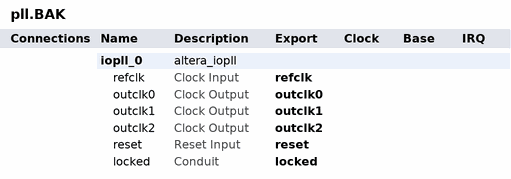
[diagram p0: system contents]
# Platform Designer (Qsys) system pll.BAK, Arria 10 10AS066H2F34I1HG
# Parameters at their usual value, and those the tool derives, are not listed.
package require -exact qsys 18.0
create_system pll.BAK
set_project_property DEVICE_FAMILY {Arria 10}
set_project_property DEVICE 10AS066H2F34I1HG

add_instance iopll_0 altera_iopll 18.0
set_instance_property iopll_0 AUTO_EXPORT true
set_instance_parameter_value iopll_0 gui_c_cnt_in_src0 c_m_cnt_in_src_ph_mux_clk
set_instance_parameter_value iopll_0 gui_c_cnt_in_src1 c_m_cnt_in_src_ph_mux_clk
set_instance_parameter_value iopll_0 gui_c_cnt_in_src2 c_m_cnt_in_src_ph_mux_clk
set_instance_parameter_value iopll_0 gui_cal_code_hex_file iossm.hex
set_instance_parameter_value iopll_0 gui_cal_converge false
set_instance_parameter_value iopll_0 gui_cal_error cal_clean
set_instance_parameter_value iopll_0 gui_clock_name_global false
set_instance_parameter_value iopll_0 gui_clock_to_compensate 0
set_instance_parameter_value iopll_0 gui_debug_mode false
set_instance_parameter_value iopll_0 gui_en_lvds_ports Disabled
set_instance_parameter_value iopll_0 gui_existing_mif_file_path {~/pll.mif}
set_instance_parameter_value iopll_0 gui_include_iossm false
set_instance_parameter_value iopll_0 gui_lock_setting {Low Lock Time}
set_instance_parameter_value iopll_0 gui_mif_config_name unnamed
set_instance_parameter_value iopll_0 gui_mif_gen_options {Generate New MIF File}
set_instance_parameter_value iopll_0 gui_new_mif_file_path {~/pll.mif}
set_instance_parameter_value iopll_0 gui_number_of_clocks 3
set_instance_parameter_value iopll_0 gui_operation_mode direct
set_instance_parameter_value iopll_0 gui_output_clock_frequency0 100.0
set_instance_parameter_value iopll_0 gui_output_clock_frequency1 26.66
set_instance_parameter_value iopll_0 gui_output_clock_frequency2 20.0
set_instance_parameter_value iopll_0 gui_parameter_table_hex_file seq_params_sim.hex
set_instance_parameter_value iopll_0 gui_pll_cal_done false
set_instance_parameter_value iopll_0 gui_pll_freqcal_en true
set_instance_parameter_value iopll_0 gui_pll_freqcal_req_flag true
set_instance_parameter_value iopll_0 gui_pll_m_cnt_in_src c_m_cnt_in_src_ph_mux_clk
set_instance_parameter_value iopll_0 gui_pll_tclk_mux_en false
set_instance_parameter_value iopll_0 gui_pll_tclk_sel pll_tclk_m_src
set_instance_parameter_value iopll_0 gui_pll_type S10_Simple
set_instance_parameter_value iopll_0 gui_pll_vco_freq_band_0 pll_freq_clk0_disabled
set_instance_parameter_value iopll_0 gui_pll_vco_freq_band_1 pll_freq_clk1_disabled
set_instance_parameter_value iopll_0 gui_reference_clock_frequency 25.0
set_instance_parameter_value iopll_0 gui_use_NDFB_modes false
set_instance_parameter_value iopll_0 gui_use_locked true
set_instance_parameter_value iopll_0 gui_usr_device_speed_grade 1
set_instance_parameter_value iopll_0 gui_vco_frequency 600.0
set_instance_parameter_value iopll_0 hp_qsys_scripting_mode false
set_instance_parameter_value iopll_0 system_info_device_component 10AS066H2F34I1HG
set_instance_parameter_value iopll_0 system_info_device_speed_grade 1
set_instance_parameter_value iopll_0 system_part_trait_speed_grade 1

# exported interfaces
add_interface locked conduit end
set_interface_property locked EXPORT_OF iopll_0.locked
add_interface outclk0 clock source
set_interface_property outclk0 EXPORT_OF iopll_0.outclk0
add_interface outclk1 clock source
set_interface_property outclk1 EXPORT_OF iopll_0.outclk1
add_interface outclk2 clock source
set_interface_property outclk2 EXPORT_OF iopll_0.outclk2
add_interface refclk clock sink
set_interface_property refclk EXPORT_OF iopll_0.refclk
add_interface reset reset sink
set_interface_property reset EXPORT_OF iopll_0.reset

set_interconnect_requirement {$system} qsys_mm.clockCrossingAdapter HANDSHAKE
set_interconnect_requirement {$system} qsys_mm.enableEccProtection FALSE
set_interconnect_requirement {$system} qsys_mm.insertDefaultSlave FALSE
set_interconnect_requirement {$system} qsys_mm.maxAdditionalLatency 1

save_system pll.BAK.qsys
